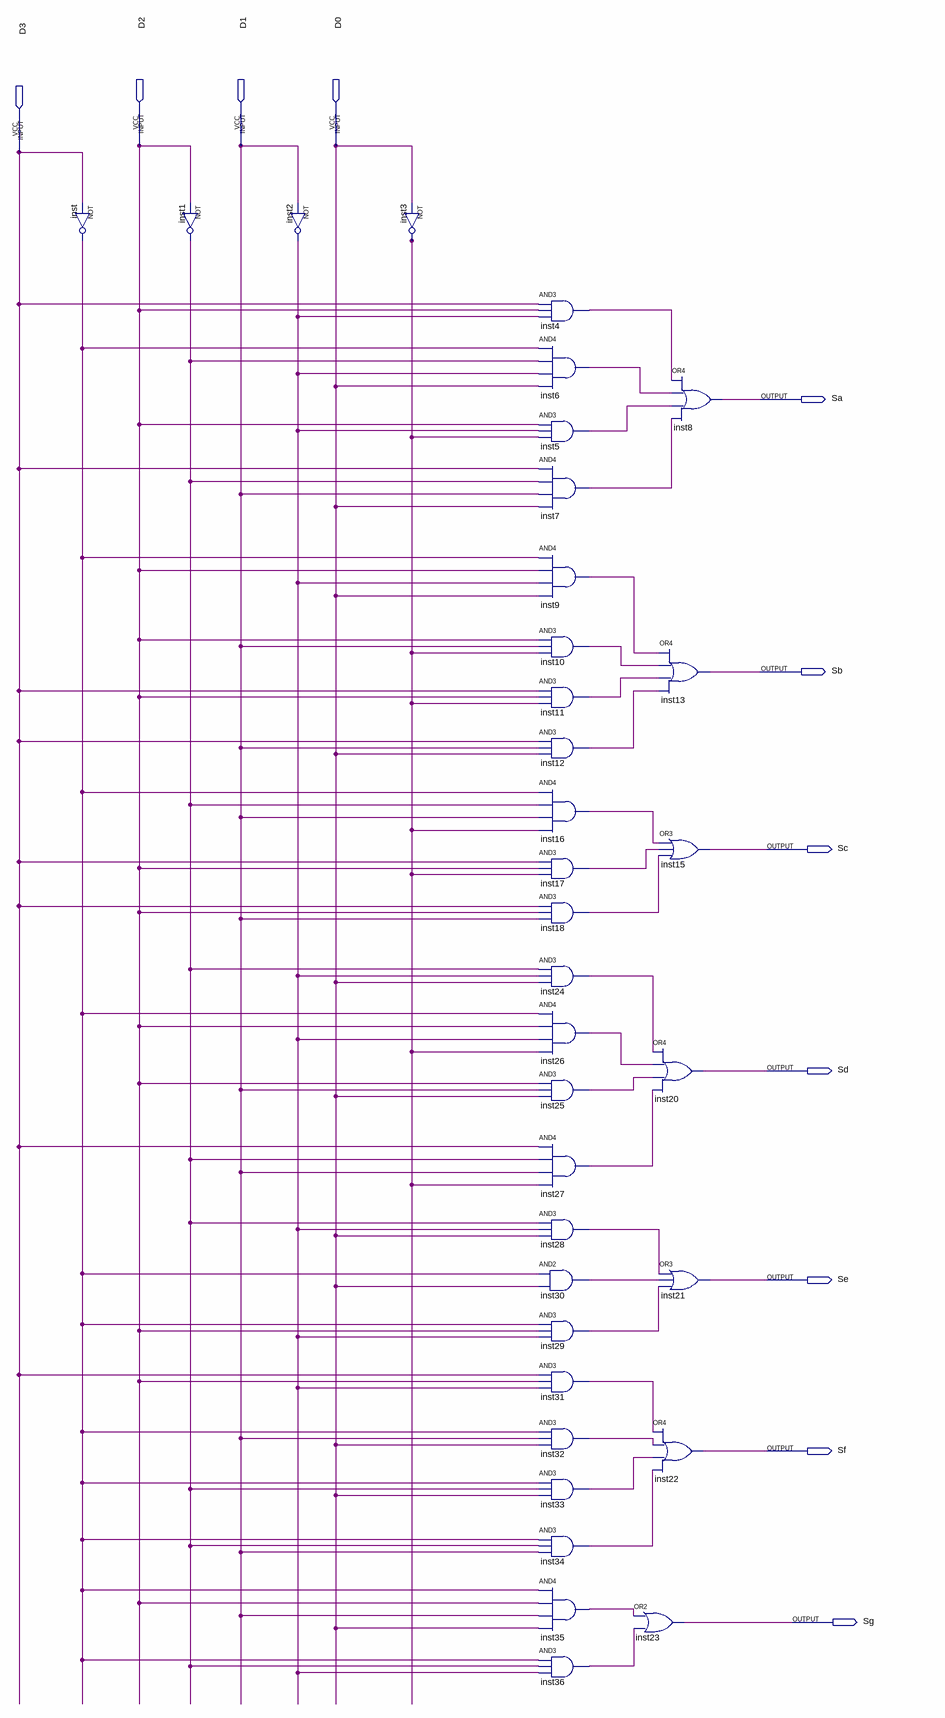
[diagram p0: schematic sheet]
// Quartus schematic Lab3.bdf as structural Verilog: 35 symbols, 11 pins
module Lab3 (
  input  D2,
  input  D1,
  input  D0,
  input  D3,
  output Sa,
  output Sb,
  output Sc,
  output Sd,
  output Se,
  output Sf,
  output Sg
);

  wire inst1_out, inst2_out, inst3_out, inst4_out, inst5_out, inst6_out, inst7_out, inst9_out, inst10_out,
       inst11_out, inst12_out, inst16_out, inst17_out, inst18_out, inst24_out, inst25_out, inst26_out,
       inst27_out, inst28_out, inst29_out, inst30_out, inst31_out, inst32_out, inst33_out, inst34_out,
       inst35_out, inst36_out, inst_out;

  not inst (inst_out, D3);
  not inst1 (inst1_out, D2);
  not inst2 (inst2_out, D1);
  not inst3 (inst3_out, D0);
  and inst4 (inst4_out, D3, D2, inst2_out);
  and inst6 (inst6_out, inst_out, inst1_out, inst2_out, D0);
  and inst5 (inst5_out, D2, inst2_out, inst3_out);
  and inst7 (inst7_out, D3, inst1_out, D1, D0);
  and inst9 (inst9_out, inst_out, D2, inst2_out, D0);
  and inst10 (inst10_out, D2, D1, inst3_out);
  and inst11 (inst11_out, D3, D2, inst3_out);
  and inst12 (inst12_out, D3, D1, D0);
  and inst16 (inst16_out, inst_out, inst1_out, D1, inst3_out);
  and inst17 (inst17_out, D3, D2, inst3_out);
  and inst18 (inst18_out, D3, D2, D1);
  and inst24 (inst24_out, inst1_out, inst2_out, D0);
  and inst26 (inst26_out, inst_out, D2, inst2_out, inst3_out);
  and inst25 (inst25_out, D2, D1, D0);
  and inst27 (inst27_out, D3, inst1_out, D1, inst3_out);
  and inst28 (inst28_out, inst1_out, inst2_out, D0);
  and inst30 (inst30_out, inst_out, D0);
  and inst29 (inst29_out, inst_out, D2, inst2_out);
  and inst31 (inst31_out, D3, D2, inst2_out);
  and inst32 (inst32_out, inst_out, D1, D0);
  and inst33 (inst33_out, inst_out, inst1_out, D0);
  and inst34 (inst34_out, inst_out, inst1_out, D1);
  and inst35 (inst35_out, inst_out, D2, D1, D0);
  and inst36 (inst36_out, inst_out, inst1_out, inst2_out);
  or inst20 (Sd, inst24_out, inst26_out, inst25_out, inst27_out);
  or inst22 (Sf, inst31_out, inst32_out, inst33_out, inst34_out);
  or inst23 (Sg, inst35_out, inst36_out);
  or inst8 (Sa, inst4_out, inst6_out, inst5_out, inst7_out);
  or inst13 (Sb, inst9_out, inst10_out, inst11_out, inst12_out);
  or inst15 (Sc, inst16_out, inst17_out, inst18_out);
  or inst21 (Se, inst28_out, inst30_out, inst29_out);
endmodule
